# Altium project pay-led-pcb.PrjPCB
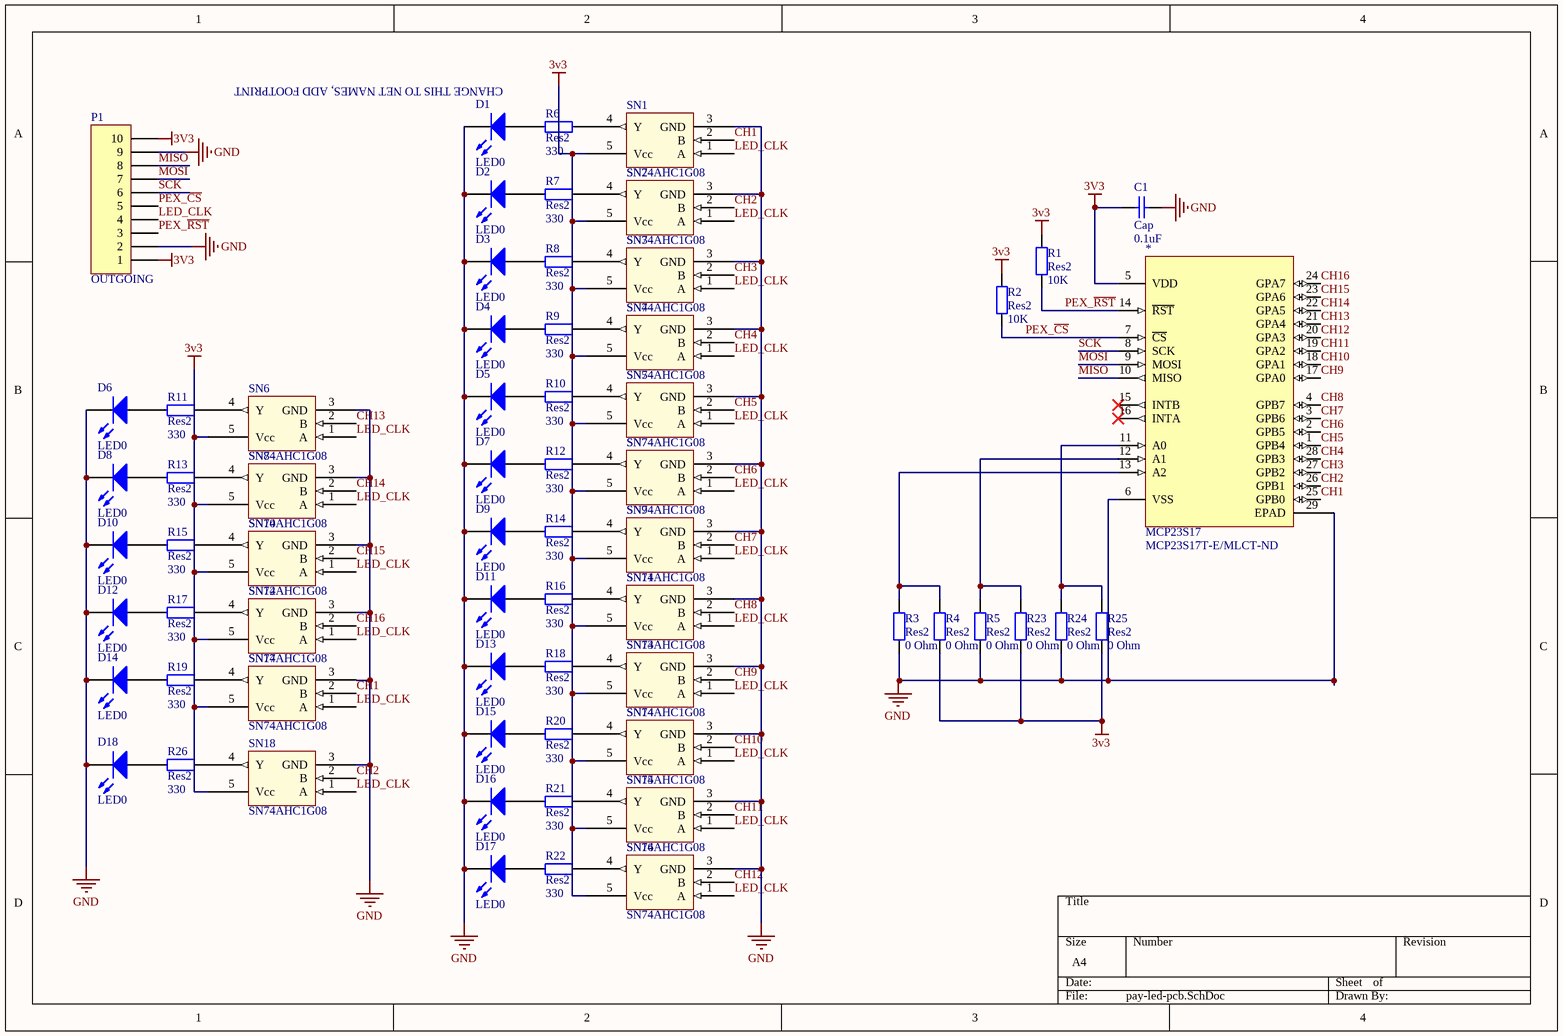
[diagram p0: pay-led-pcb.SchDoc]
1 sheet, 65 parts. Net scope: global (net labels, ports and power ports of the same name join across sheets).
Board file: pay-led-pcb.PcbDoc

## Sheet pay-led-pcb.SchDoc: pay-led-pcb
size A4; DrawnBy: Lorna Lan; Organization: UTAT; Revision: v2.0; SheetNumber: 1; SheetTotal: 1

### Parts
*  MCP23S17  Supplier Part Number 1: MCP23S17T-E/MLCT-ND  [QFN65P600X600X100-29N]
C1  Cap  value 0.1uF  [1608[0603]]
D1  LED0  [LB P4SG]
D2  LED0  [LB P4SG]
D3  LED0  [LB P4SG]
D4  LED0  [LB P4SG]
D5  LED0  [LB P4SG]
D6  LED0  [LB P4SG]
D7  LED0  [LB P4SG]
D8  LED0  [LB P4SG]
D9  LED0  [LB P4SG]
D10  LED0  [LB P4SG]
D11  LED0  [LB P4SG]
D12  LED0  [LB P4SG]
D13  LED0  [LB P4SG]
D14  LED0  [LB P4SG]
D15  LED0  [LB P4SG]
D16  LED0  [LB P4SG]
D17  LED0  [LB P4SG]
D18  LED0  [LB P4SG]
P1  OUTGOING  [DF14-10P-1.25H(55)]
R1  Res2  value 10K  [J1-0603]
R2  Res2  value 10K  [J1-0603]
R3  Res2  value 0 Ohm  [J1-0603]
R4  Res2  value 0 Ohm  [J1-0603]
R5  Res2  value 0 Ohm  [J1-0603]
R6  Res2  value 330  [J1-0603]
R7  Res2  value 330  [J1-0603]
R8  Res2  value 330  [J1-0603]
R9  Res2  value 330  [J1-0603]
R10  Res2  value 330  [J1-0603]
R11  Res2  value 330  [J1-0603]
R12  Res2  value 330  [J1-0603]
R13  Res2  value 330  [J1-0603]
R14  Res2  value 330  [J1-0603]
R15  Res2  value 330  [J1-0603]
R16  Res2  value 330  [J1-0603]
R17  Res2  value 330  [J1-0603]
R18  Res2  value 330  [J1-0603]
R19  Res2  value 330  [J1-0603]
R20  Res2  value 330  [J1-0603]
R21  Res2  value 330  [J1-0603]
R22  Res2  value 330  [J1-0603]
R23  Res2  value 0 Ohm  [J1-0603]
R24  Res2  value 0 Ohm  [J1-0603]
R25  Res2  value 0 Ohm  [J1-0603]
R26  Res2  value 330  [J1-0603]
SN1  SN74AHC1G08  [SOT-23-5_95P290X160-5N]
SN2  SN74AHC1G08  [SOT-23-5_95P290X160-5N]
SN3  SN74AHC1G08  [SOT-23-5_95P290X160-5N]
SN4  SN74AHC1G08  [SOT-23-5_95P290X160-5N]
SN5  SN74AHC1G08  [SOT-23-5_95P290X160-5N]
SN6  SN74AHC1G08  [SOT-23-5_95P290X160-5N]
SN7  SN74AHC1G08  [SOT-23-5_95P290X160-5N]
SN8  SN74AHC1G08  [SOT-23-5_95P290X160-5N]
SN9  SN74AHC1G08  [SOT-23-5_95P290X160-5N]
SN10  SN74AHC1G08  [SOT-23-5_95P290X160-5N]
SN11  SN74AHC1G08  [SOT-23-5_95P290X160-5N]
SN12  SN74AHC1G08  [SOT-23-5_95P290X160-5N]
SN13  SN74AHC1G08  [SOT-23-5_95P290X160-5N]
SN14  SN74AHC1G08  [SOT-23-5_95P290X160-5N]
SN15  SN74AHC1G08  [SOT-23-5_95P290X160-5N]
SN16  SN74AHC1G08  [SOT-23-5_95P290X160-5N]
SN17  SN74AHC1G08  [SOT-23-5_95P290X160-5N]
SN18  SN74AHC1G08  [SOT-23-5_95P290X160-5N]

### Nets
3v3: *.5(VDD) C1.2 P1.1 P1.10 R1.1 R2.1 R4.1 R23.1 R25.1 SN1.5(Vcc) SN2.5(Vcc) SN3.5(Vcc) SN4.5(Vcc) SN5.5(Vcc) SN6.5(Vcc) SN7.5(Vcc) SN8.5(Vcc) SN9.5(Vcc) SN10.5(Vcc) SN11.5(Vcc) SN12.5(Vcc) SN13.5(Vcc) SN14.5(Vcc) SN15.5(Vcc) SN16.5(Vcc) SN17.5(Vcc) SN18.5(Vcc)
GND: *.6(VSS) *.29(EPAD) C1.1 D1.2(K) D2.2(K) D3.2(K) D4.2(K) D5.2(K) D6.2(K) D7.2(K) D8.2(K) D9.2(K) D10.2(K) D11.2(K) D12.2(K) D13.2(K) D14.2(K) D15.2(K) D16.2(K) D17.2(K) D18.2(K) P1.2 P1.9 R3.1 R5.1 R24.1 SN1.3(GND) SN2.3(GND) SN3.3(GND) SN4.3(GND) SN5.3(GND) SN6.3(GND) SN7.3(GND) SN8.3(GND) SN9.3(GND) SN10.3(GND) SN11.3(GND) SN12.3(GND) SN13.3(GND) SN14.3(GND) SN15.3(GND) SN16.3(GND) SN17.3(GND) SN18.3(GND)
CH1: *.25(GPB0) SN1.2(B) SN17.2(B)
CH2: *.26(GPB1) SN2.2(B) SN18.2(B)
CH3: *.27(GPB2) SN3.2(B)
CH4: *.28(GPB3) SN4.2(B)
CH5: *.1(GPB4) SN5.2(B)
CH6: *.2(GPB5) SN7.2(B)
CH7: *.3(GPB6) SN9.2(B)
CH8: *.4(GPB7) SN11.2(B)
CH9: *.17(GPA0) SN13.2(B)
CH10: *.18(GPA1) SN14.2(B)
CH11: *.19(GPA2) SN15.2(B)
CH12: *.20(GPA3) SN16.2(B)
CH13: *.21(GPA4) SN6.2(B)
CH14: *.22(GPA5) SN8.2(B)
CH15: *.23(GPA6) SN10.2(B)
CH16: *.24(GPA7) SN12.2(B)
LED_CLK: P1.4 SN1.1(A) SN2.1(A) SN3.1(A) SN4.1(A) SN5.1(A) SN6.1(A) SN7.1(A) SN8.1(A) SN9.1(A) SN10.1(A) SN11.1(A) SN12.1(A) SN13.1(A) SN14.1(A) SN15.1(A) SN16.1(A) SN17.1(A) SN18.1(A)
MISO: *.10(MISO) P1.8
MOSI: *.9(MOSI) P1.7
PEX_~{CS}: *.7(~{CS}) P1.5 R2.2
PEX_~{RST}: *.14(~{RST}) P1.3 R1.2
SCK: *.8(SCK) P1.6
Net*_11: *.11(A0) R24.2 R25.2
Net*_12: *.12(A1) R5.2 R23.2
Net*_13: *.13(A2) R3.2 R4.2
NetD1_1: D1.1(A) R6.1
NetD2_1: D2.1(A) R7.1
NetD3_1: D3.1(A) R8.1
NetD4_1: D4.1(A) R9.1
NetD5_1: D5.1(A) R10.1
NetD6_1: D6.1(A) R11.1
NetD7_1: D7.1(A) R12.1
NetD8_1: D8.1(A) R13.1
NetD9_1: D9.1(A) R14.1
NetD10_1: D10.1(A) R15.1
NetD11_1: D11.1(A) R16.1
NetD12_1: D12.1(A) R17.1
NetD13_1: D13.1(A) R18.1
NetD14_1: D14.1(A) R19.1
NetD15_1: D15.1(A) R20.1
NetD16_1: D16.1(A) R21.1
NetD17_1: D17.1(A) R22.1
NetD18_1: D18.1(A) R26.1
NetR6_2: R6.2 SN1.4(Y)
NetR7_2: R7.2 SN2.4(Y)
NetR8_2: R8.2 SN3.4(Y)
NetR9_2: R9.2 SN4.4(Y)
NetR10_2: R10.2 SN5.4(Y)
NetR11_2: R11.2 SN6.4(Y)
NetR12_2: R12.2 SN7.4(Y)
NetR13_2: R13.2 SN8.4(Y)
NetR14_2: R14.2 SN9.4(Y)
NetR15_2: R15.2 SN10.4(Y)
NetR16_2: R16.2 SN11.4(Y)
NetR17_2: R17.2 SN12.4(Y)
NetR18_2: R18.2 SN13.4(Y)
NetR19_2: R19.2 SN17.4(Y)
NetR20_2: R20.2 SN14.4(Y)
NetR21_2: R21.2 SN15.4(Y)
NetR22_2: R22.2 SN16.4(Y)
NetR26_2: R26.2 SN18.4(Y)

Not connected (* = marked no-connect by the designer): * 15(INTB)* 16(INTA)*

### Notes on the sheet
- (near D1) CHANGE THIS TO NET NAMES, ADD FOOTPRINT

### Library data of the parts
* = MCP23S17: 16-bit I/O expander.; Supplier 1: Digi-Key
C1 = Cap: Capacitor; Published: 8-Jun-2000; LatestRevisionDate: 17-Jul-2002; LatestRevisionNote: Re-released for DXP Platform.; PackageReference: RAD-0.3; Publisher: Altium Limited; PackageDescription: Radial Cap, Thru-Hole; 2 Leads; 0.3 in Pin Spacing
D1-D18 = LED0: Typical INFRARED GaAs LED; Published: 8-Jun-2000; LatestRevisionDate: 08-Jul-2005; LatestRevisionNote: Mech Layer 1 removed.; PackageReference: LED-0; Publisher: Altium Limited; PackageDescription: LED; 2 Leads
P1 = Header 10: Header, 10-Pin; LatestRevisionDate: 17-Jul-2002; LatestRevisionNote: Re-released for DXP Platform.; Publisher: Altium Limited; Supplier: Digi-Key
R1-R26 = Res2: Resistor; Published: 8-Jun-2000; LatestRevisionDate: 17-Jul-2002; LatestRevisionNote: Re-released for DXP Platform.; PackageReference: AXIAL-0.4; Publisher: Altium Limited; PackageDescription: Axial Device, Thru-Hole; 2 Leads; 0.4 in Pin Spacing